# EAGLE design truelog (EAGLE 7.6.0)
CNAME: TrueLog attenuator; DESIGNER: e.asphyx@gmail.com
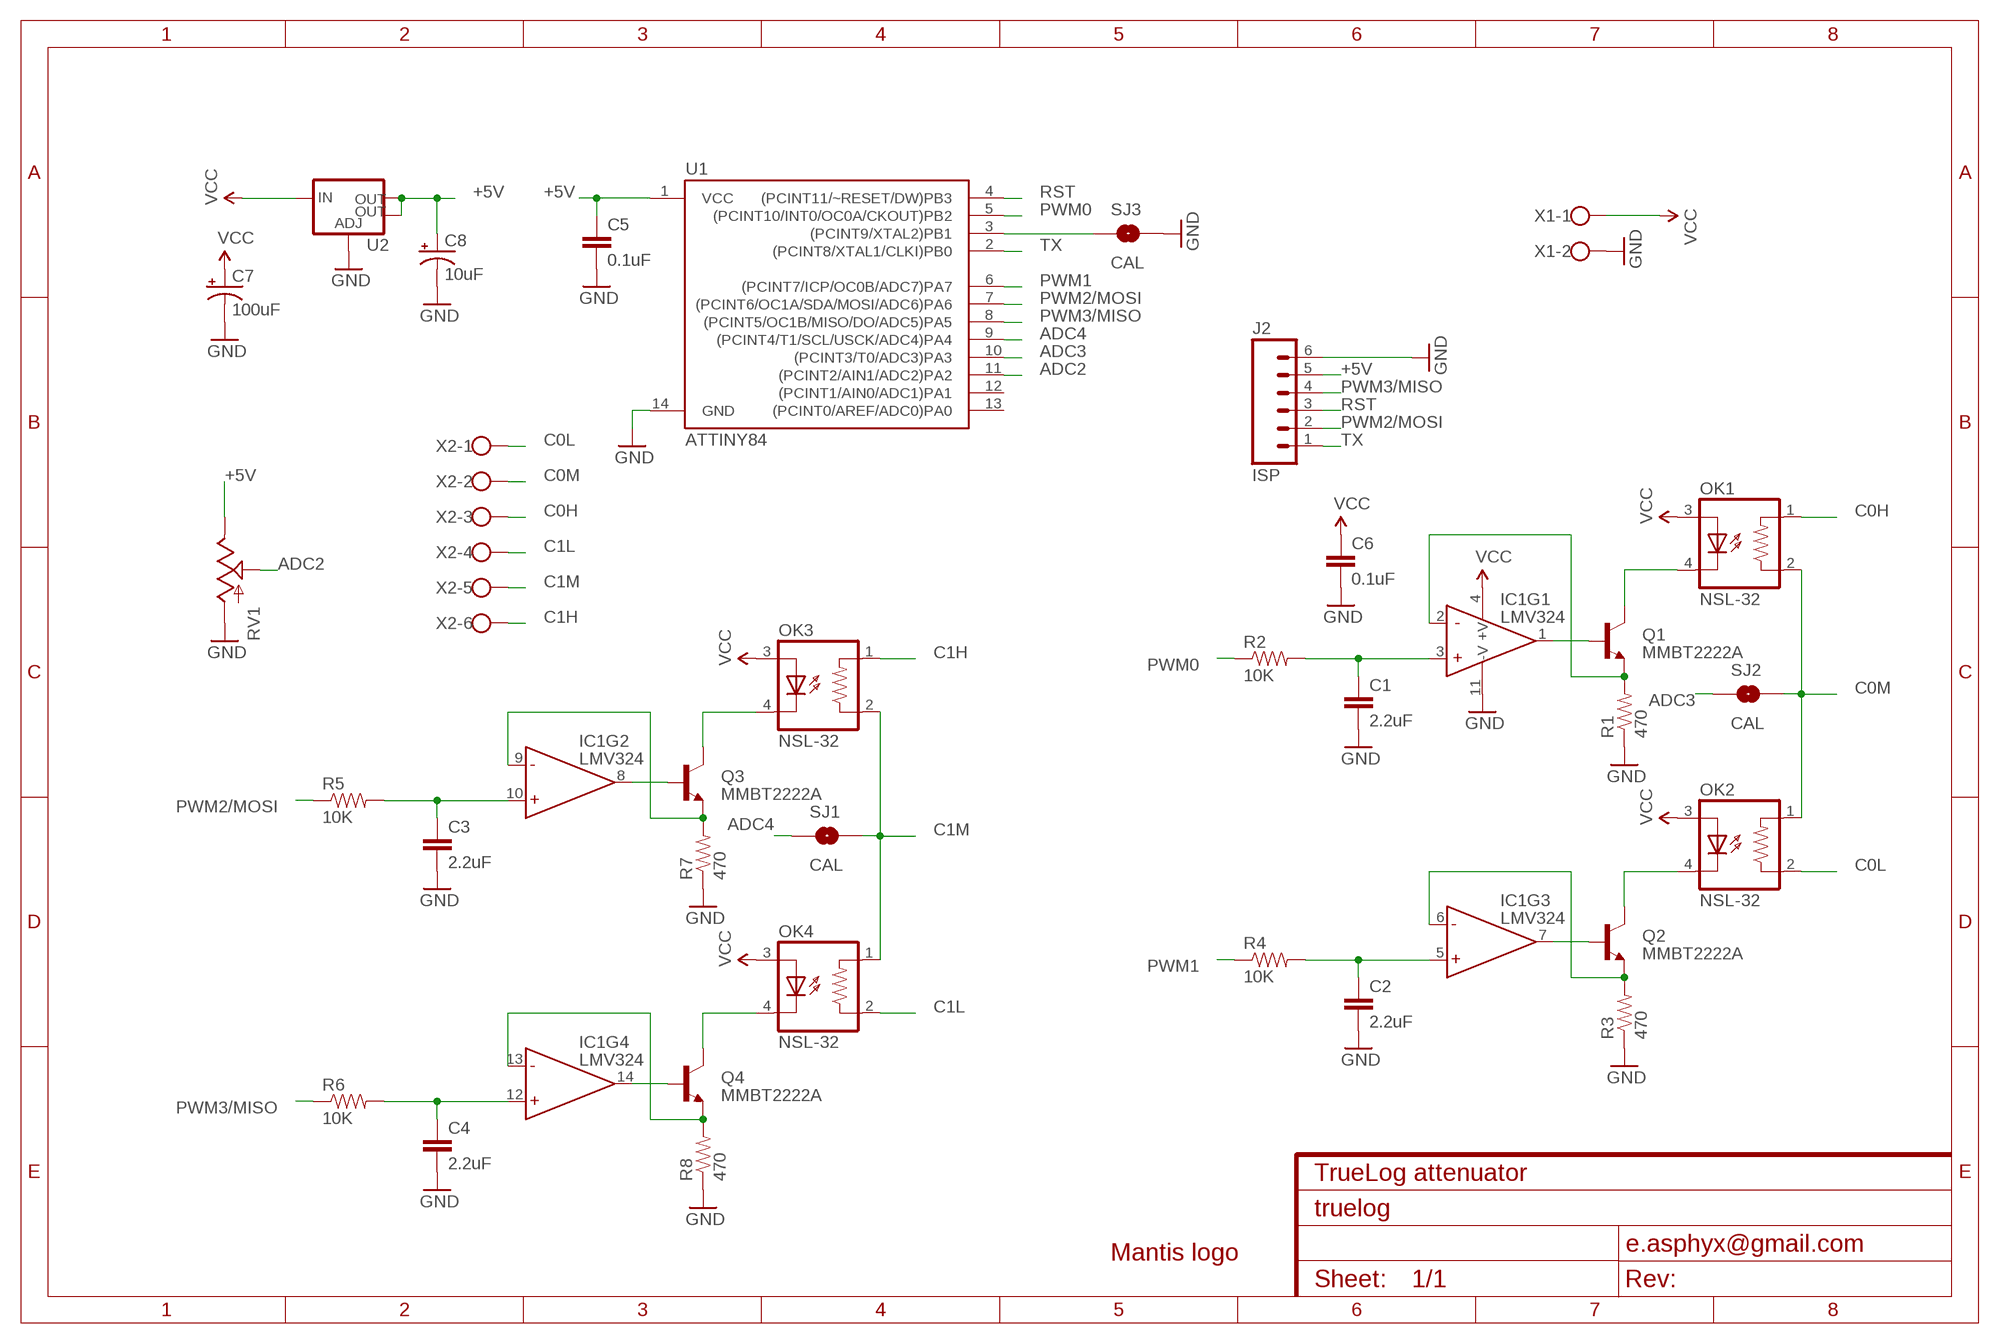
[diagram p0: schematic, sheet 1]

## Parts
C1  2.2uF  2.2UF-25V-+80/-20(0805)  [0805-CAP]
C2  2.2uF  2.2UF-25V-+80/-20(0805)  [0805-CAP]
C3  2.2uF  2.2UF-25V-+80/-20(0805)  [0805-CAP]
C4  2.2uF  2.2UF-25V-+80/-20(0805)  [0805-CAP]
C5  0.1uF  0.1UF-25V(+80/-20%)(0603)  [0603-CAP]
C6  0.1uF  0.1UF-25V(+80/-20%)(0603)  [0603-CAP]
C7  100uF  CAP_POLD  [PANASONIC_D]
C8  10uF  CAP_POLC  [PANASONIC_C]
IC1  LMV324  [SO014]
J2  ISP  M06LOCK  [1X06_LOCK]
LOGO1  LOGO-MANTIS  [LOGO-MANTIS]
OK1  NSL-32  [NSL-OK]
OK2  NSL-32  [NSL-OK]
OK3  NSL-32  [NSL-OK]
OK4  NSL-32  [NSL-OK]
Q1  MMBT2222A  TRANSISTOR_NPNMMBT2222A  [SOT23-3]
Q2  MMBT2222A  TRANSISTOR_NPNMMBT2222A  [SOT23-3]
Q3  MMBT2222A  TRANSISTOR_NPNMMBT2222A  [SOT23-3]
Q4  MMBT2222A  TRANSISTOR_NPNMMBT2222A  [SOT23-3]
R1  470  0.22OHM-1/4W-1%(0805)  [0805]
R2  10K  10KOHM-1/10W-1%(0603)0603  [0603-RES]
R3  470  0.22OHM-1/4W-1%(0805)  [0805]
R4  10K  10KOHM-1/10W-1%(0603)0603  [0603-RES]
R5  10K  10KOHM-1/10W-1%(0603)0603  [0603-RES]
R6  10K  10KOHM-1/10W-1%(0603)0603  [0603-RES]
R7  470  0.22OHM-1/4W-1%(0805)  [0805]
R8  470  0.22OHM-1/4W-1%(0805)  [0805]
RV1  POT  [ALPS_POT]
SJ1  CAL  SOLDERJUMPERNO  [SJ_2S-NO]
SJ2  CAL  SOLDERJUMPERNO  [SJ_2S-NO]
SJ3  CAL  SOLDERJUMPERNO  [SJ_2S-NO]
U1  ATTINY84  [SO14]
U2  V_REG_LM1117SOT223  [SOT223]
X1  W237-102  [W237-102]
X2  W237-136  [W237-136]

## Nets
+5V [pwr]: C5.1 C8.+ J2.5 RV1.P$1(E) U1.1(VCC) U2.2(OUT) U2.4(OUT)
ADC2: RV1.P$2(S) U1.11((PCINT2/AIN1/ADC2)PA2)
ADC3: SJ2.1 U1.10((PCINT3/T0/ADC3)PA3)
ADC4: SJ1.1 U1.9((PCINT4/T1/SCL/USCK/ADC4)PA4)
C0H [signal]: OK1.1(R0) X2.3
C0L [signal]: OK2.2(R1) X2.1
C0M [signal]: OK1.2(R1) OK2.1(R0) SJ2.2 X2.2
C1H [signal]: OK3.1(R0) X2.6
C1L [signal]: OK4.2(R1) X2.4
C1M [signal]: OK3.2(R1) OK4.1(R0) SJ1.2 X2.5
GND: C1.2 C2.2 C3.2 C4.2 C5.2 C6.2 C7.- C8.- IC1.11(-V) J2.6 R1.1 R3.1 R7.1 R8.1 RV1.P$3(A) SJ3.2 U1.14(GND) U2.1(ADJ) X1.2
N$1: SJ3.1 U1.3((PCINT9/XTAL2)PB1)
N$3 [led]: OK1.4(C) Q1.3(C)
N$4 [led]: IC1.2(-IN) Q1.2(E) R1.2
N$5: C1.1 IC1.3(+IN) R2.2
N$7: IC1.1(OUT) Q1.1(B)
N$8: IC1.7(OUT) Q2.1(B)
N$9: IC1.8(OUT) Q3.1(B)
N$10 [led]: OK2.4(C) Q2.3(C)
N$11 [led]: OK3.4(C) Q3.3(C)
N$12 [led]: OK4.4(C) Q4.3(C)
N$13 [led]: IC1.6(-IN) Q2.2(E) R3.2
N$14: C2.1 IC1.5(+IN) R4.2
N$15: C3.1 IC1.10(+IN) R5.2
N$16: C4.1 IC1.12(+IN) R6.2
N$17: IC1.14(OUT) Q4.1(B)
N$18 [led]: IC1.9(-IN) Q3.2(E) R7.2
N$19 [led]: IC1.13(-IN) Q4.2(E) R8.2
PWM0: R2.1 U1.5((PCINT10/INT0/OC0A/CKOUT)PB2)
PWM1: R4.1 U1.6((PCINT7/ICP/OC0B/ADC7)PA7)
PWM2/MOSI: J2.2 R5.1 U1.7((PCINT6/OC1A/SDA/MOSI/ADC6)PA6)
PWM3/MISO: J2.4 R6.1 U1.8((PCINT5/OC1B/MISO/DO/ADC5)PA5)
RST: J2.3 U1.4((PCINT11/~RESET/DW)PB3)
TX: J2.1 U1.2((PCINT8/XTAL1/CLKI)PB0)
VCC [pwr]: C6.1 C7.+ IC1.4(+V) OK1.3(A) OK2.3(A) OK3.3(A) OK4.3(A) U2.3(IN) X1.1
Unconnected: U1.12((PCINT1/AIN0/ADC1)PA1) U1.13((PCINT0/AREF/ADC0)PA0)

## Library data of the parts
C1-C4 = SparkFun-Capacitors:2.2UF-25V-+80/-20(0805): CAP-11624; PROD_ID: CAP-11624
C5 C6 = SparkFun-Capacitors:0.1UF-25V(+80/-20%)(0603): CAP-00810 Ceramic Standard decoupling cap; PROD_ID: CAP-00810
C7 C8 = SparkFun-Capacitors:CAP_POL: Capacitor Polarized These are standard SMD and PTH capacitors. Normally 10uF, 47uF, and 100uF in electrolytic and tantalum varieties. Always verify the external diameter of the through hole cap, it varies with capacity, voltage, and manufacturer. The EIA devices should be standard.
IC1 = SparkFun-AnalogIC:LMV324: Jellybean quad op-amp; PROD_ID: IC-08227
J2 = SparkFun-Connectors:M06: Header 6 Standard 6-pin 0.1" header. Use with straight break away headers (SKU : PRT-00116), right angle break away headers (PRT-00553), swiss pins (PRT-00743), machine pins (PRT-00117), and female headers (PRT-00115). Molex polarized connector foot print use with SKU : PRT-08094 with associated crimp pins and housings. NOTES ON THE VARIANTS LOCK and LOCK_LONGPADS... This footprint was designed to help hold the alignment of a through-hole component (i.e. 6-pin header) while soldering it into place. You may notice that each hole has been shifted either up or down by 0.005 of an inch from it's more standard position (which is a perfectly straight line). This slight alteration caused the pins (the squares in the middle) to touch the edges of the holes. Because they are alternating, it causes a "brace" to hold the component in place. 0.005 has proven to be the perfect amount of "off-center" position when using our standard breakaway headers. Although looks a little odd when you look at the bare footprint, once you have a header in there, the alteration is very hard to notice. Also,if you push a header all the way into place, it is covered up entirely on the bottom side. This idea of altering the position of holes to aid alignment will be further integrated into the Sparkfun Library for other footprints. It can help hold any component with 3 or more connection pins.
LOGO1 = my:LOGO-MANTIS: Mantis logo
OK1-OK4 = my:NSL-32: NSL-32x Resistive Optocouplers
Q1-Q4 = SparkFun-DiscreteSemi:TRANSISTOR_NPN: Generic NPN BJT MMBT2222A - TRANS-08049 (SOT-23, 1A 40V) MPSA42 - TRANS-09116 (SOT-23, 500mA 300V) MMBT5088LT1G - TRANS-11160 (SOT-23, 50 mA 30V) BC547 - COM-08928 <http://www.sparkfun.com/products/8928> (TO-92 45V 100mA) (1.Collector 2.Base 3.Emitter) 2N3904 - COM-00521 <http://www.sparkfun.com/products/521> (TO-92 40V 200mA) (1.Emitter 2.Base 3.Collector) P2N2222A - COM-12852 <http://www.sparkfun.com/products/12852> (TO-92 40V 600mA) (1.Collector 2.Base 3.Emitter); PROD_ID: TRANS-08049
R1 R3 R7 R8 = SparkFun-Resistors:0.22OHM-1/4W-1%(0805): RES-09883; PROD_ID: RES-09883; VALUE: 0.22
R2 R4-R6 = SparkFun-Resistors:10KOHM-1/10W-1%(0603): RES-00824; PROD_ID: RES-00824
RV1 = SparkFun-Electromechanical:POT; PROD_ID: RES-09177
SJ1-SJ3 = SparkFun-Retired:SOLDERJUMPER: Solder Jumper Standard SMD solder jumper. Used to automate production. Two varients : Normally Open and Normally Closed are the same, but have different paste layers. NC will have a large amount of paste and should jumper during reflow.
U1 = my:ATTINY84: Atmel 14-pin 2/4/8kB flash uC; PROD_ID: IC-11285
U2 = SparkFun-PowerIC:V_REG_LM1117: Voltage Regulator LM1117 Standard adjustable voltage regulator but in SMD form. Spark Fun Electronics SKU : COM-00595; PROD_ID: VREG-08170
X1 = con-wago-500:W237-102: WAGO SCREW CLAMP; MPN: 237-102; OC_FARNELL: unknown; OC_NEWARK: 70K9898
X2 = con-wago-500:W237-136: WAGO SCREW CLAMP; MPN: 237-136; OC_FARNELL: unknown; OC_NEWARK: 84K9151

## Net classes
1 pwr: width 0.813 mm
2 signal: width 0.61 mm
3 led: width 0.406 mm

## Board
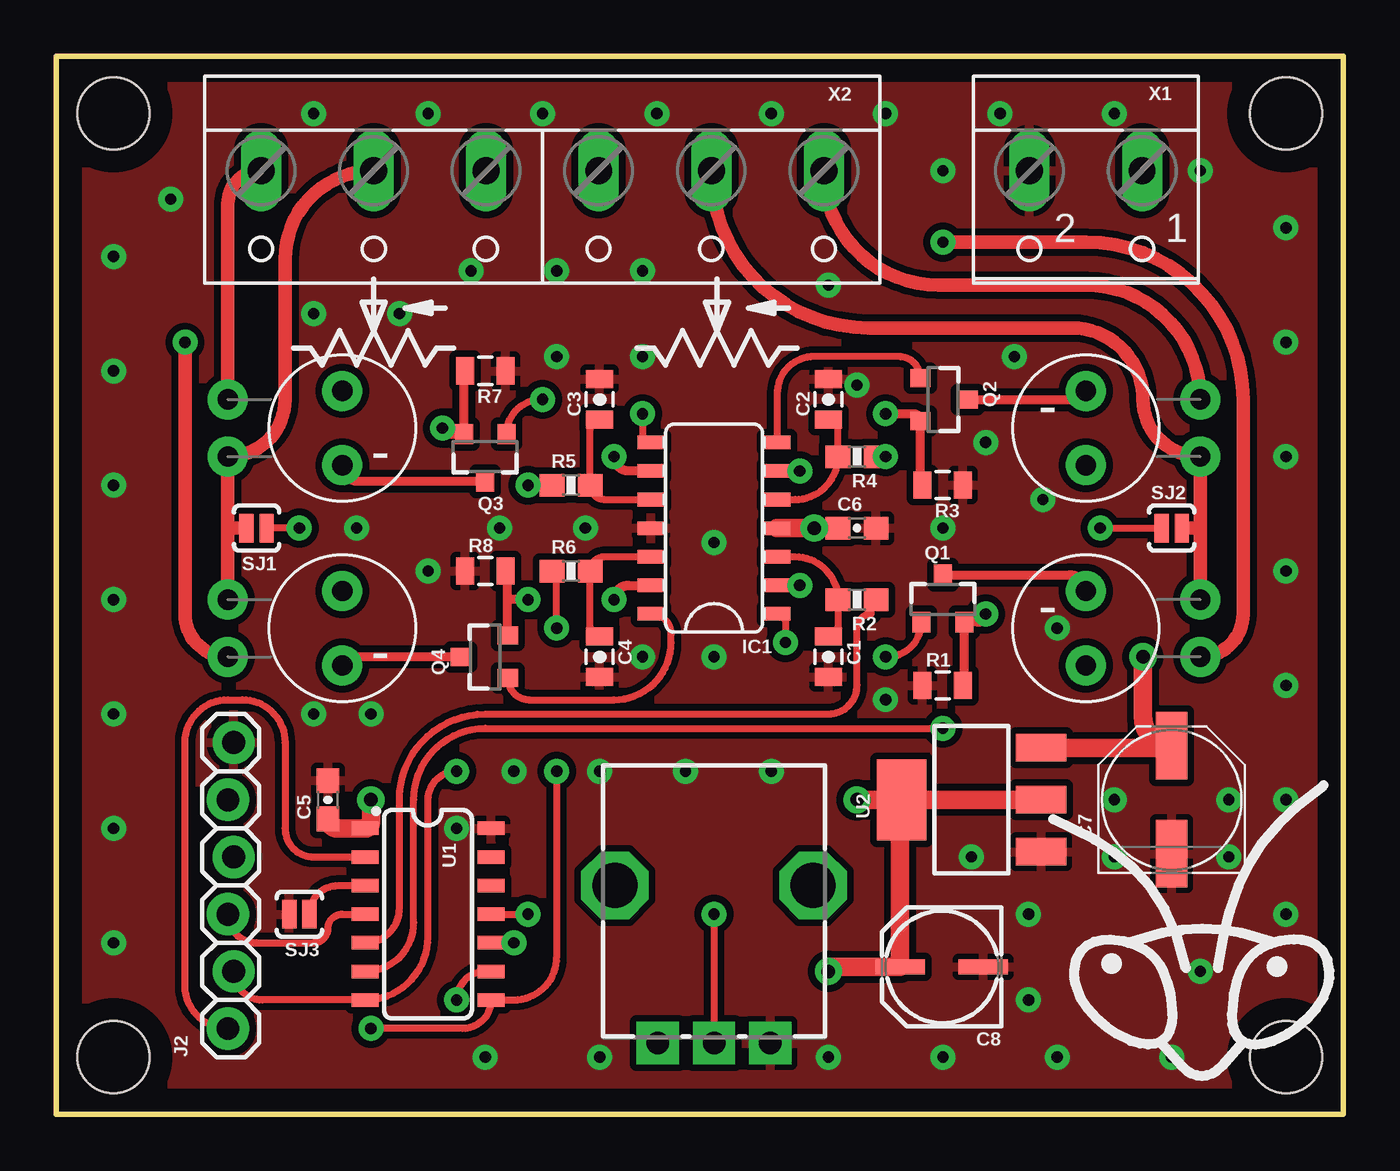
[diagram p1: board, top side]
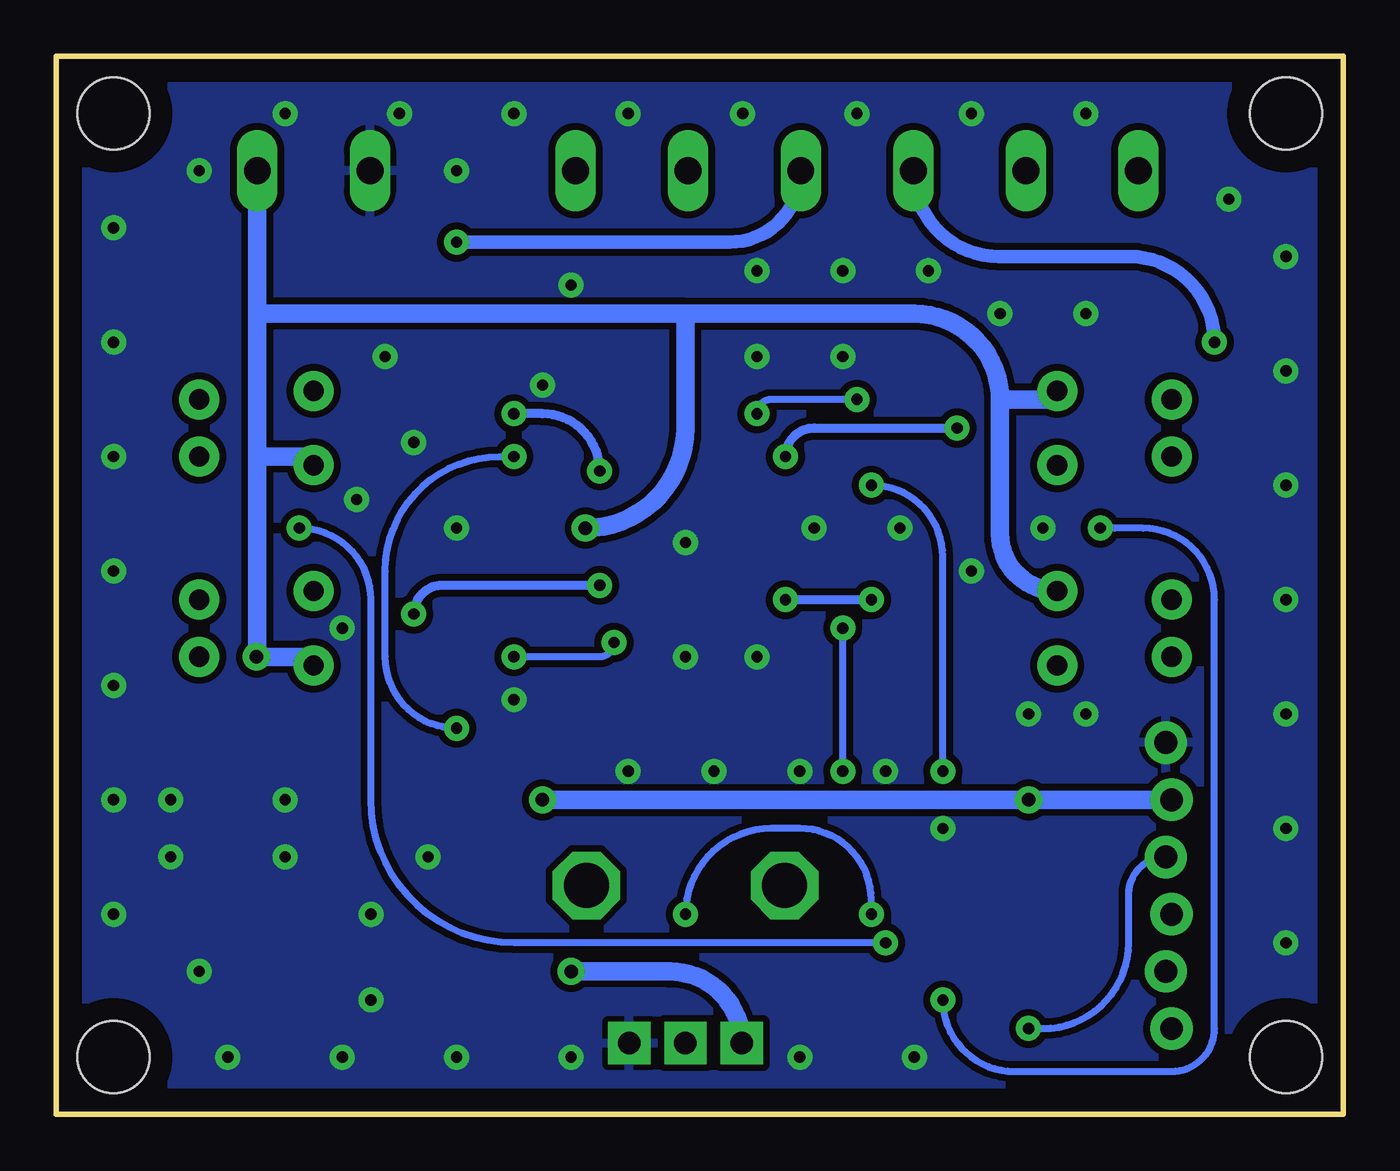
[diagram p2: board, bottom side, seen from below]

Size 57.15 x 46.99 mm. Coordinates in mm from the lower left corner, seen from the top.
Outline: 0,0 0,46.99 57.15,46.99 57.15,0 0,0
Copper layers (1*16): Top 0.035mm / dielectric 1.5mm / Bottom 0.035mm
Design rules "default *": minimum track width 12mil, minimum drill 12mil, track to track 12mil, track to pad 12mil, pad to pad 12mil, via to via 12mil, smd to smd 0mil, copper to edge 40mil, drill to drill 8mil, minimum pad ring 12mil, minimum via ring 12mil, stop-mask expansion 4mil, vias tented up to drill 0mil, thermal gap 10mil
Holes 3.2 mm at 2.54,44.45 54.61,44.45 54.61,2.54 2.54,2.54

### Footprints (pad centres in the part's own frame; a part is rotated, then mirrored left to right if it is on the bottom)
0805-CAP = smd 0.8 x 1.2: 1 -0.9,0; 2 0.9,0
0603-CAP = smd 1.1 x 1: 1 -0.85,0; 2 0.85,0
PANASONIC_D = smd 3 x 1.4: + 2.4,0; - -2.4,0
PANASONIC_C = smd 2.2 x 0.65: + 1.9,-0.2; - -1.8,-0.2
SO014 = smd 0.6 x 1.2: 1 -3.175,-2.8; 2 -1.905,-2.8; 3 -0.635,-2.8; 4 0.635,-2.8; 5 1.905,-2.8; 6 3.175,-2.8; 7 4.445,-2.8; 8 4.445,2.8; 9 3.175,2.8; 10 1.905,2.8; 11 0.635,2.8; 12 -0.635,2.8; 13 -1.905,2.8; 14 -3.175,2.8
1X06_LOCK = drill 1.016 pad 1.88: 1 0,0; 2 2.54,-0.254; 3 5.08,0; 4 7.62,-0.254; 5 10.16,0; 6 12.7,-0.254
NSL-OK = drill 0.9 pad 1.778: 1 -3.81,1.27; 2 -3.81,-1.27; 3 1.27,1.651; 4 1.27,-1.651
SOT23-3 = smd 0.8 x 0.9: 1 -0.95,-1; 2 0.95,-1; 3 0,1.1
0805 = smd 0.8 x 1.2: 1 -0.9,0; 2 0.9,0
0603-RES = smd 1.1 x 1: 1 -0.85,0; 2 0.85,0
ALPS_POT = drill 1 pad 1.88 square: P$1 7,-2.5; P$2 7,0; P$3 7,2.5 | drill 2 octagon: P$4 0,-4.4; P$5 0,4.4
SJ_2S-NO = smd 0.635 x 1.27: 1 -0.45,0; 2 0.45,0
SO14 = smd 0.6 x 1.2: 1 -3.81,-2.8; 2 -2.54,-2.8; 3 -1.27,-2.8; 4 0,-2.8; 5 1.27,-2.8; 6 2.54,-2.8; 7 3.81,-2.8; 8 3.81,2.8; 9 2.54,2.8; 10 1.27,2.8; 11 0,2.8; 12 -1.27,2.8; 13 -2.54,2.8; 14 -3.81,2.8
SOT223 = smd 1.219 x 2.235: 1 -2.311,-3.099; 2 0,-3.099; 3 2.311,-3.099 | smd 3.6 x 2.2: 4 0,3.099
W237-102 = drill 1.194 long: 1 -2.5,-1.27; 2 2.5,-1.27
W237-136 = drill 1.194 long: 1 -12.5,-1.27; 2 -7.5,-1.27; 3 -2.5,-1.27; 4 2.5,-1.27; 5 7.5,-1.27; 6 12.5,-1.27

### Placement (x,y rotation side)
C1  34.29,20.32 270 top
C2  34.29,31.75 90 top
C3  24.13,31.75 90 top
C4  24.13,20.32 270 top
C5  12.06,13.97 90 top
C6  35.56,26.04 0 top
C7  49.53,13.97 90 top
C8  39.37,6.35 180 top
IC1  29.21,25.4 90 top
J2  7.62,3.81 90 top
LOGO1  50.8,8.26 0 top
OK1  46.99,21.59 180 top
OK2  46.99,30.48 180 top
OK3  11.43,30.48 0 top
OK4  11.43,21.59 0 top
Q1  39.37,22.86 0 top
Q2  39.37,31.75 270 top
Q3  19.05,29.21 180 top
Q4  19.05,20.32 90 top
R1  39.37,19.05 0 top
R2  35.56,22.86 180 top
R3  39.37,27.94 180 top
R4  35.56,29.21 180 top
R5  22.86,27.94 0 top
R6  22.86,24.13 0 top
R7  19.05,33.02 180 top
R8  19.05,24.13 0 top
RV1  29.21,10.16 270 top
SJ1  8.89,26.04 180 top
SJ2  49.53,26.04 0 top
SJ3  10.79,8.89 180 top
U1  16.51,8.89 270 top
U2  40.64,13.97 90 top
U$1  [POT-SYMBOL]  14.61,34.29 90 top
U$2  [POT-SYMBOL]  29.84,34.29 90 top
X1  45.72,40.64 180 top
X2  21.59,40.64 180 top

### Tracks (layer width: path | path; a pad name or v marks a point on that pad's centre or on a via)
+5V  (via drill 0.6)
  Top 0.813: U2.2 U2.4 | U2.4 v35.56,13.97 | U2.4 arc90 37.47,13.9 C8.+ 34.49,6.55 arc90 v34.29,6.35 | C5.1 arc90 12.48,12.7 U1.1 arc90 13.97,12.96 v13.97,13.97
  Bottom 0.813: v35.56,13.97 v13.97,13.97 J2.5 | RV1.P$1 arc-90 29.9,6.35 v34.29,6.35
ADC2  (via drill 0.5)
  Top 0.305: U1.11 v20.95,8.89 | v29.21,8.89 RV1.P$2
  Bottom 0.305: v20.95,8.89 20.95,9.53 arc-90 24.13,12.7 25.4,12.7 arc-90 v29.21,8.89
ADC3  (via drill 0.5)
  Top 0.305: U1.10 v20.32,7.62 | v46.35,26.04 SJ2.1
  Bottom 0.305: v20.32,7.62 36.83,7.62 arc90 43.18,13.97 43.18,22.86 arc-90 v46.35,26.04
ADC4  (via drill 0.5)
  Top 0.305: U1.9 19.05,6.35 arc90 v17.78,5.08 | v10.79,26.04 SJ1.1
  Bottom 0.305: v17.78,5.08 arc-90 14.61,1.91 7.62,1.91 arc-90 5.71,3.81 5.71,22.86 arc-90 8.89,26.04 v10.79,26.04 10.16,26.04
C0H  (via drill 0.5)
  Top 0.61: OK1.1 arc90 52.7,22.23 52.7,31.75 arc90 45.72,38.73 v39.37,38.73
  Bottom 0.61: v39.37,38.73 27.27,38.73 arc-90 X2.3
C0L
  Top 0.61: X2.1 arc90 39.17,36.83 45.72,36.83 arc-90 OK2.2
C0M
  Top 0.61: OK1.2 50.8,26.04 | 50.8,26.04 OK2.1 arc-90 48.26,31.75 arc90 45.09,34.92 36.08,34.92 arc-90 X2.2 | SJ2.2 50.8,26.04
C1H
  Top 0.61: OK3.1 7.62,40.44 arc-90 X2.6
C1L  (via drill 0.5)
  Top 0.61: OK4.2 arc-90 5.71,22.23 v5.71,34.29
  Bottom 0.61: v5.71,34.29 arc-90 9.53,38.1 15.28,38.1 arc90 X2.4
C1M
  Top 0.61: OK4.1 7.62,26.04 | 7.62,26.04 OK3.2 arc90 10.16,31.75 10.16,37.98 arc-90 X2.5 | SJ1.2 7.62,26.04
GND  (via drill 0.5)
  other vias: 2.54,7.62 2.54,12.7 2.54,17.78 2.54,22.86 2.54,27.94 2.54,33.02 2.54,38.1 5.08,40.64 11.43,44.45 16.51,44.45 21.59,44.45 26.67,44.45 31.75,44.45 36.83,44.45 41.91,44.45 46.99,44.45 50.8,41.91 39.37,41.91 54.61,39.37 54.61,34.29 54.61,29.21 54.61,24.13 54.61,19.05 54.61,13.97 54.61,8.89 50.8,6.35 49.53,2.54 44.45,2.54 39.37,2.54 34.29,2.54 24.13,2.54 19.05,2.54 11.43,17.78 13.97,17.78 20.32,15.24 24.13,15.24 17.78,12.7 43.18,5.08 43.18,8.89 46.99,11.43 52.07,11.43 40.64,11.43 35.56,32.38 39.37,26.04 41.27,29.84 22.23,33.66 26.04,33.66 26.04,20.32 16.51,24.13 36.83,18.41 27.94,15.24 31.75,15.24 29.21,20.32 29.21,25.4 23.5,26.04 19.68,26.04 43.81,27.3 46.99,13.97 52.07,13.97 44.45,21.59 42.55,33.66 13.34,26.04 15.24,35.56 11.43,35.56 18.41,37.47 22.23,37.47 26.04,37.47 34.29,36.83
  pour Top (isolate 0.305): 0,46.99 57.15,46.99 57.15,0 0,0
  pour Bottom (isolate 0.305): 0,46.99 57.15,46.99 57.15,0 0,0
N$1
  Top 0.305: SJ3.1 arc-90 12.52,10.16 U1.3
N$3
  Top 0.406: Q1.3 45,23.96 arc-90 OK1.4
N$4  (via drill 0.5)
  Top 0.406: R1.2 arc90 40.32,19.1 Q1.2 40.91,21.86 arc90 v41.27,22.23 | IC1.2 v33.02,23.5
  Bottom 0.406: v33.02,23.5 40.01,23.5 arc-90 v41.27,22.23
N$5
  Top 0.305: IC1.3 32.8,24.77 arc-90 R2.2 34.71,21.64 arc-90 C1.1
N$7  (via drill 0.5)
  Top 0.305: IC1.1 arc-90 32.38,21.85 v32.38,20.95 | v36.83,20.32 36.88,20.32 arc90 Q1.1
  Bottom 0.305: v32.38,20.95 arc90 33.02,20.32 v36.83,20.32
N$8
  Top 0.305: IC1.7 32.01,32.01 arc-90 33.66,33.66 37.41,33.66 arc-90 Q2.1
N$9  (via drill 0.5)
  Top 0.305: Q3.1 arc-90 21.54,31.75 v21.59,31.75 | v26.04,31.11 26.04,30.22 arc90 IC1.8
  Bottom 0.305: v21.59,31.75 25.4,31.75 arc-90 v26.04,31.11
N$10
  Top 0.406: Q2.3 45.34,31.75 arc90 OK2.4
N$11
  Top 0.406: Q3.3 13.42,28.11 arc-90 OK3.4
N$12
  Top 0.406: Q4.3 13.08,20.32 arc90 OK4.4
N$13  (via drill 0.5)
  Top 0.406: R3.2 arc-90 38.37,28.04 Q2.2 arc90 38.05,31.11 v36.83,31.11 | IC1.6 v33.02,28.57
  Bottom 0.406: v33.02,28.57 arc-90 35.56,31.11 v36.83,31.11
N$14
  Top 0.305: IC1.5 32.8,27.3 arc90 R4.2 34.71,30.43 arc90 C2.1
N$15
  Top 0.305: C3.1 arc90 23.71,30.43 R5.2 arc90 24.34,27.3 IC1.10
N$16
  Top 0.305: IC1.12 24.34,24.77 arc90 R6.2 23.71,21.64 arc90 C4.1
N$17
  Top 0.305: Q4.1 arc90 21,18.41 24.77,18.41 arc90 27.3,20.95 27.3,21.33 arc90 IC1.14
N$18  (via drill 0.5)
  Top 0.406: R7.2 arc90 18.1,32.97 Q3.2 17.41,30.21 arc-90 v17.14,30.48 | IC1.9 25.4,28.57 arc-90 v24.77,29.21
  Bottom 0.406: v24.77,29.21 arc90 23.5,30.48 v17.14,30.48
N$19  (via drill 0.5)
  Top 0.406: Q4.2 20.05,22.86 | 20.05,22.86 20.05,24.03 arc90 R8.2 | v20.95,22.86 20.05,22.86 | v24.77,22.86 arc-90 25.4,23.5 IC1.13
  Bottom 0.406: v24.77,22.86 v20.95,22.86
PWM0
  Top 0.305: U1.5 arc90 15.24,9.15 15.24,13.97 arc-90 19.05,17.78 34.29,17.78 arc90 35.56,19.05 35.56,21.59 arc-90 36.2,22.23 36.2,22.64 arc-90 R2.1
PWM1  (via drill 0.5)
  Top 0.305: U1.6 arc90 15.88,8.52 15.88,13.97 arc-90 19.05,17.14 v39.37,17.14 | v36.83,29.21 R4.1
  Bottom 0.305: v39.37,17.14 arc90 42.55,20.32 42.55,24.13 arc90 37.47,29.21 v36.83,29.21
PWM2/MOSI  (via drill 0.5)
  Top 0.305: J2.2 arc90 9.14,5.08 U1.7 arc90 16.51,7.88 16.51,13.97 arc-90 v17.78,15.24 | v20.95,27.94 R5.1
  Bottom 0.305: v17.78,15.24 17.78,24.77 arc-90 v20.95,27.94
PWM3/MISO  (via drill 0.5)
  Top 0.305: v22.23,21.59 22.23,23.91 arc90 R6.1 | v22.23,15.24 22.23,6.99 arc-90 20.32,5.08 U1.8 arc-90 18.04,3.81 v13.97,3.81
  Bottom 0.305: v22.23,15.24 v22.23,21.59 | v13.97,3.81 13.34,3.81 arc-90 9.53,7.62 9.53,9.78 arc90 J2.4
RST
  Top 0.305: J2.3 arc90 8.89,7.62 11.43,7.62 arc90 12.06,8.26 arc-90 12.7,8.89 U1.4
TX
  Top 0.305: J2.1 arc-90 5.71,5.71 5.71,16.51 arc-90 7.62,18.41 8.26,18.41 arc-90 10.16,16.51 10.16,12.7 arc90 11.43,11.43 U1.2
VCC  (via drill 0.6)
  Top 0.813: v48.26,20.32 48.26,17.64 arc90 C7.+ arc-90 49.44,16.28 U2.3 | IC1.4 v33.66,26.04 C6.1
  Bottom 0.813: X1.1 48.22,35.56 | 48.22,35.56 48.22,29.21 | 48.22,29.21 48.22,20.36 arc90 v48.26,20.32 46.1,20.32 arc90 OK1.3 | OK2.3 arc-90 46.1,29.21 48.22,29.21 | v33.66,26.04 arc-90 29.21,30.48 29.21,35.56 | 29.21,35.56 19.05,35.56 arc90 15.24,31.75 | 15.24,31.75 15.24,25.78 arc-90 OK4.3 | OK3.3 arc90 13.08,31.75 15.24,31.75 | 29.21,35.56 48.22,35.56

### Text on the board
Measures: 9-15V DC